# Altium schematic sheet Screen.SchDoc
size A3
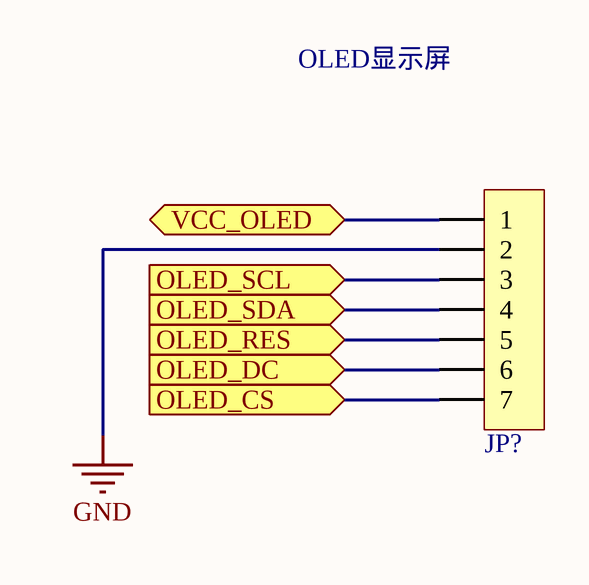
[diagram p0: Screen.SchDoc]

## Parts
JP?  HDR-1X7  [HDR2.54-M-LI-7P]  (value not drawn)

## Ports
OLED_CS (in), OLED_DC (in), OLED_RES (in), OLED_SCL (in), OLED_SDA (in), VCC_OLED (bidir)

## Nets
GND: JP?.2
OLED_CS: JP?.7 ; port OLED_CS
OLED_DC: JP?.6 ; port OLED_DC
OLED_RES: JP?.5 ; port OLED_RES
OLED_SCL: JP?.3 ; port OLED_SCL
OLED_SDA: JP?.4 ; port OLED_SDA
VCC_OLED: JP?.1 ; port VCC_OLED

## Notes on the sheet
- OLED显示屏

## Library data of the parts
JP? = Header 7: 7P接插件; 版权归属: 源创客; BOM名称: 7P接插件; 学习资源: www.ooocke.com